# EAGLE schematic Interrupt (EAGLE 6.3)
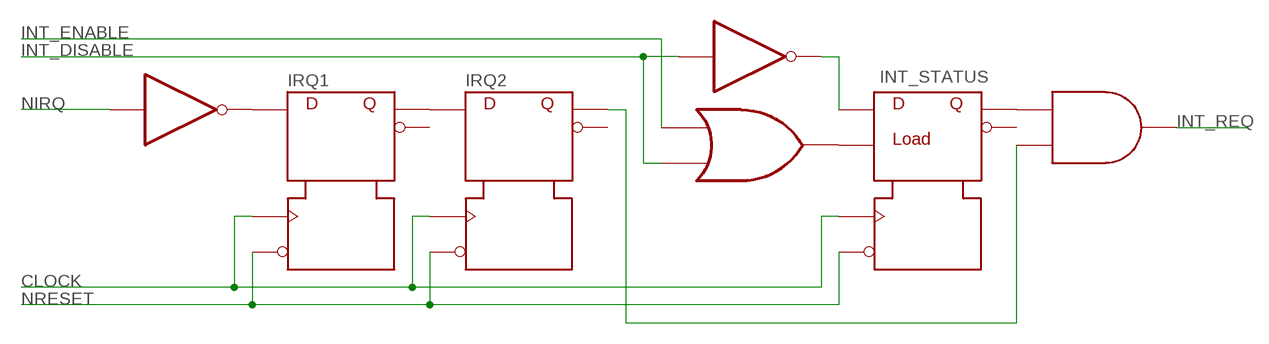
[diagram p0: schematic, sheet 1]

## Parts
AND2_1  AND2  [3PIN]
INT_STATUS  SCANREG  [6PIN]
INV_1  INV  [3PIN]
INV_2  INV  [3PIN]
IRQ1  SCANDTYPE  [5PIN]
IRQ2  SCANDTYPE  [5PIN]
OR2_1  OR2  [3PIN]

## Nets
CLOCK: INT_STATUS.P$1(CLOCK) IRQ1.P$1(CLOCK) IRQ2.P$1(CLOCK)
INT_DISABLE: INV_2.P$1(I) OR2_1.P$2(I1)
INT_ENABLE: OR2_1.P$1(I0)
INT_REQ: AND2_1.P$3(O)
IRQ2: AND2_1.P$2(I1) IRQ2.P$5(Q)
N$1: IRQ1.P$5(Q) IRQ2.P$2(D)
N$2: INV_1.P$2(O) IRQ1.P$2(D)
N$3: INT_STATUS.P$3(LOAD) OR2_1.P$3(O)
N$4: AND2_1.P$1(A) INT_STATUS.P$6(Q)
N$7: INT_STATUS.P$2(D) INV_2.P$2(O)
NIRQ: INV_1.P$1(I)
NRESET: INT_STATUS.P$5(NRESET) IRQ1.P$4(NRESET) IRQ2.P$4(NRESET)
Unconnected: INT_STATUS.P$4(NQ) IRQ1.P$3(NQ) IRQ2.P$3(NQ)

## Library data of the parts
AND2_1 = c035u:AND2
INT_STATUS = c035u:SCANREG
INV_1 INV_2 = c035u:INV
IRQ1 IRQ2 = c035u:SCANDTYPE
OR2_1 = c035u:OR2